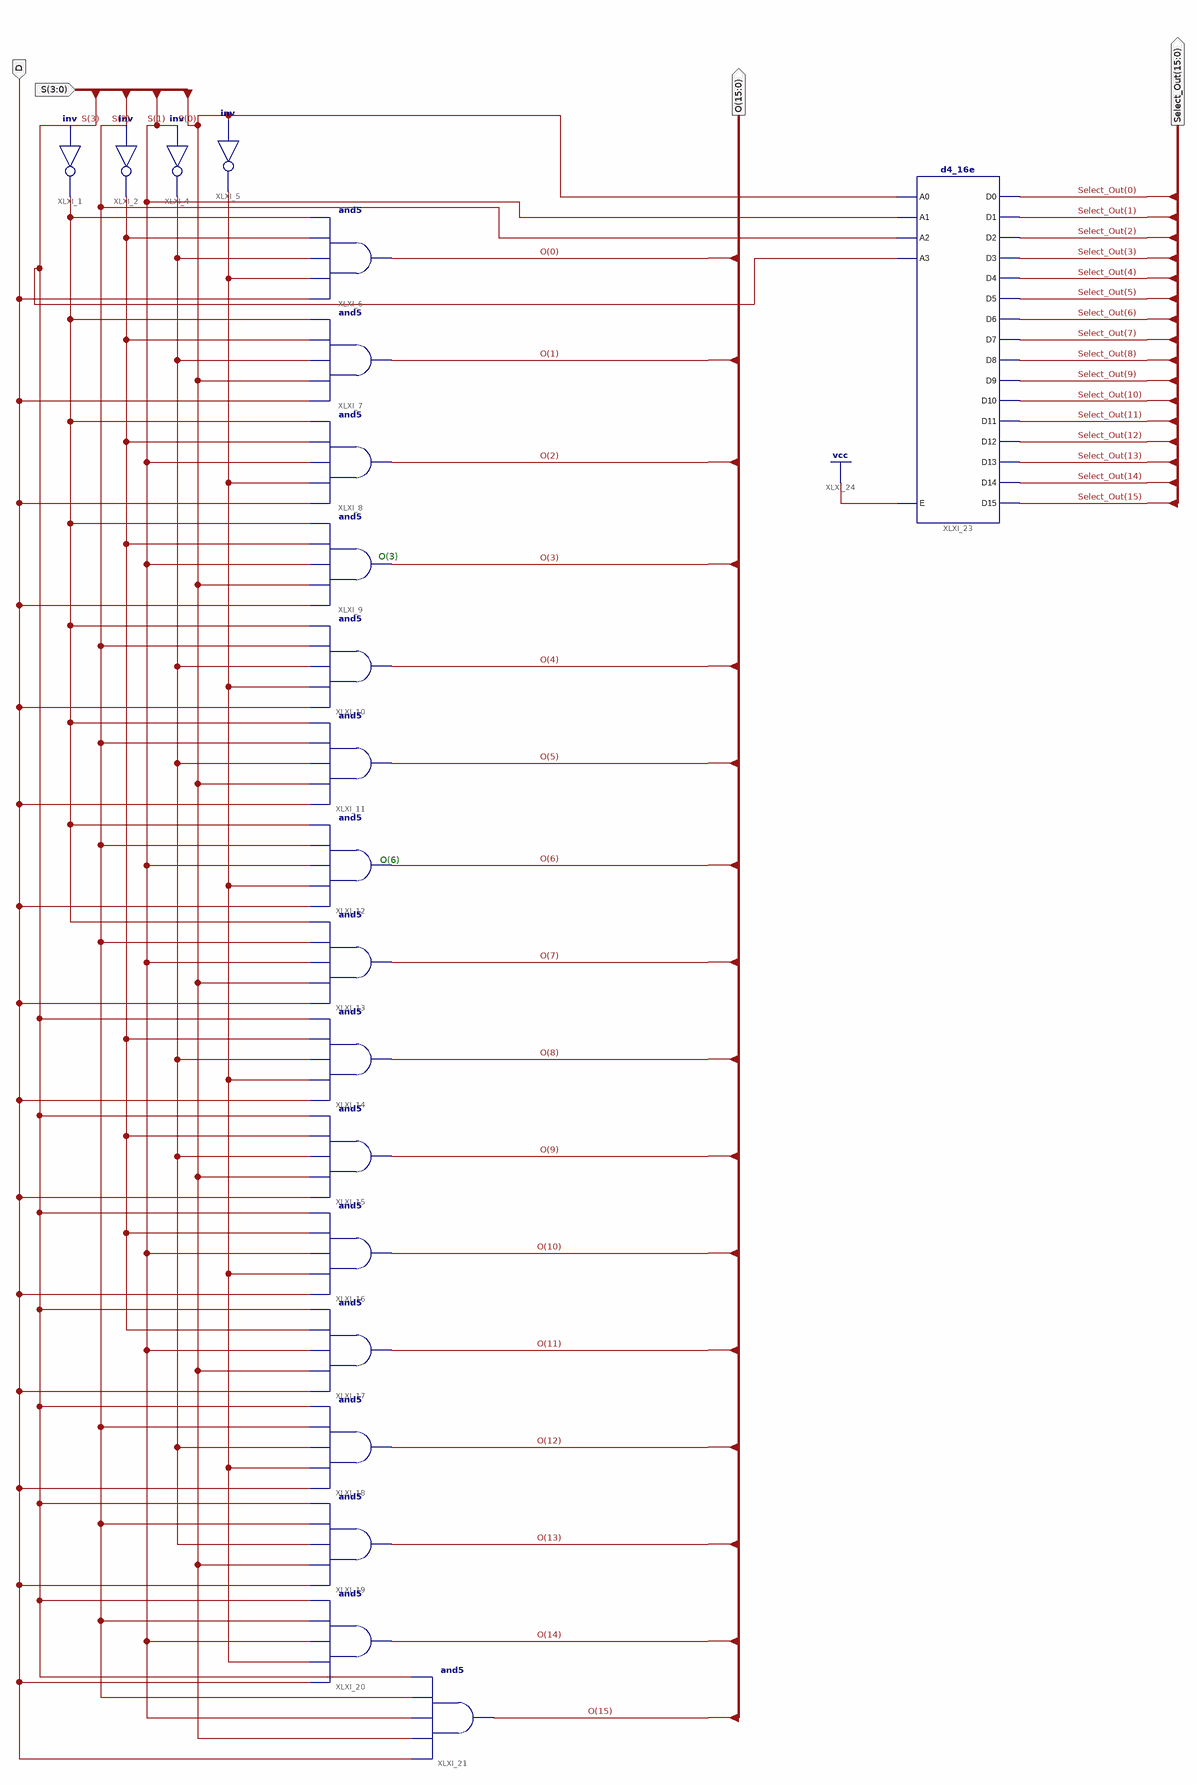
[diagram p0: schematic sheet 1]
// Xilinx ISE schematic deMux1to16bit.sch (spartan6) as structural Verilog: 21 symbols, 4 ports
module deMux1to16bit (
  input  [3:0] S,
  input  D,
  output [15:0] O,
  output [15:0] Select_Out
);

  wire XLXN_4, XLXN_6, XLXN_16, XLXN_24;

  not XLXI_1 (XLXN_4, S[3]);
  not XLXI_2 (XLXN_6, S[2]);
  not XLXI_4 (XLXN_16, S[1]);
  not XLXI_5 (XLXN_24, S[0]);
  and XLXI_6 (O[0], D, XLXN_24, XLXN_16, XLXN_6, XLXN_4);
  and XLXI_7 (O[1], D, S[0], XLXN_16, XLXN_6, XLXN_4);
  and XLXI_8 (O[2], D, XLXN_24, S[1], XLXN_6, XLXN_4);
  and XLXI_9 (O[3], D, S[0], S[1], XLXN_6, XLXN_4);
  and XLXI_10 (O[4], D, XLXN_24, XLXN_16, S[2], XLXN_4);
  and XLXI_11 (O[5], D, S[0], XLXN_16, S[2], XLXN_4);
  and XLXI_12 (O[6], D, XLXN_24, S[1], S[2], XLXN_4);
  and XLXI_13 (O[7], D, S[0], S[1], S[2], XLXN_4);
  and XLXI_14 (O[8], D, XLXN_24, XLXN_16, XLXN_6, S[3]);
  and XLXI_15 (O[9], D, S[0], XLXN_16, XLXN_6, S[3]);
  and XLXI_16 (O[10], D, XLXN_24, S[1], XLXN_6, S[3]);
  and XLXI_17 (O[11], D, S[0], S[1], XLXN_6, S[3]);
  and XLXI_18 (O[12], D, XLXN_24, XLXN_16, S[2], S[3]);
  and XLXI_19 (O[13], D, S[0], XLXN_16, S[2], S[3]);
  and XLXI_20 (O[14], D, XLXN_24, S[1], S[2], S[3]);
  and XLXI_21 (O[15], D, S[0], S[1], S[2], S[3]);
  d4_16e XLXI_23 (
    .A0(S[0]), .A1(S[1]), .A2(S[2]), .A3(S[3]), .E(1'b1), .D0(Select_Out[0]), .D1(Select_Out[1]),
    .D10(Select_Out[10]), .D11(Select_Out[11]), .D12(Select_Out[12]), .D13(Select_Out[13]),
    .D14(Select_Out[14]), .D15(Select_Out[15]), .D2(Select_Out[2]), .D3(Select_Out[3]), .D4(Select_Out[4]),
    .D5(Select_Out[5]), .D6(Select_Out[6]), .D7(Select_Out[7]), .D8(Select_Out[8]), .D9(Select_Out[9]));

  // Notes on the sheet:
  //   O(3)
  //   O(6)
endmodule
